# Altium schematic sheet Bluetooth.SchDoc
size A4; SheetNumber: 4; SheetTotal: 4
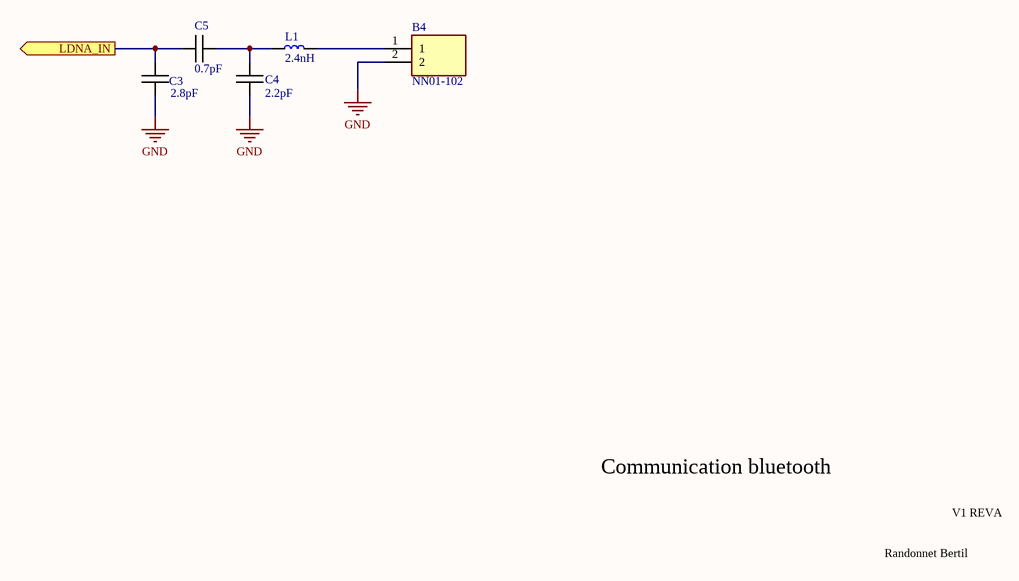
[diagram p0: Bluetooth.SchDoc]

## Parts
B4  NN01-102  [NN01-102]
C3  2.8pF  [CAPC1005X06N]
C4  2.2pF  [CAPC1005X06N]
C5  0.7pF  [CAPC1005X06N]
L1  2.4nH  [LQPC1005X06N]

## Ports
LDNA_IN (out)

## Nets
GND: B4.2 C3.2 C4.2
LDNA_IN: C3.1 C5.1 ; port LDNA_IN
NetB4_1: B4.1 L1.2
NetC4_1: C4.1 C5.2 L1.1

## Notes on the sheet
- Communication bluetooth
- V1 REVA
- Randonnet Bertil

## Library data of the parts
B4 = NN01-102: Antennes Compact Reach Xtend 2.4 GHz
C3-C5 = Capacitor
L1 = Bobine